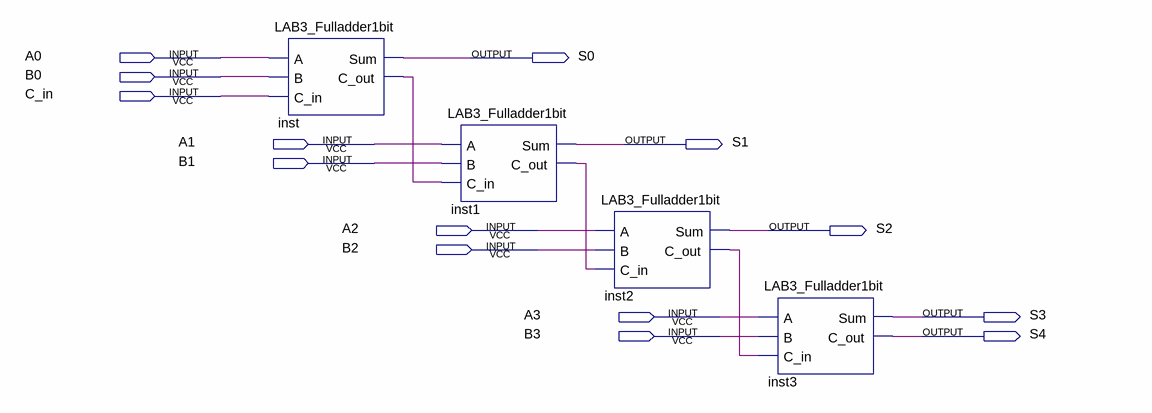
[diagram p0: schematic sheet]
// Quartus schematic LAB3_Full_adder_4bit.bdf as structural Verilog: 4 symbols, 14 pins
module LAB3_Full_adder_4bit (
  input  A0,
  input  B0,
  input  C_in,
  input  A1,
  input  B1,
  input  A2,
  input  B2,
  input  A3,
  input  B3,
  output S0,
  output S1,
  output S2,
  output S3,
  output S4
);

  wire inst1_c_out, inst2_c_out, inst_c_out;

  LAB3_Fulladder1bit inst (.A(A0), .B(B0), .C_in(C_in), .Sum(S0), .C_out(inst_c_out));
  LAB3_Fulladder1bit inst1 (.A(A1), .B(B1), .C_in(inst_c_out), .Sum(S1), .C_out(inst1_c_out));
  LAB3_Fulladder1bit inst2 (.A(A2), .B(B2), .C_in(inst1_c_out), .Sum(S2), .C_out(inst2_c_out));
  LAB3_Fulladder1bit inst3 (.A(A3), .B(B3), .C_in(inst2_c_out), .Sum(S3), .C_out(S4));
endmodule
